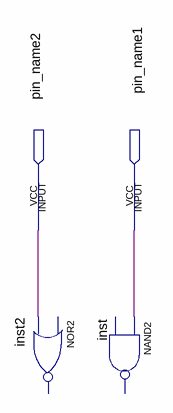
[diagram p0: schematic sheet]
// Quartus schematic Somador_74_283.bdf as structural Verilog: 2 symbols, 2 pins
module Somador_74_283 (
  input  pin_name2,
  input  pin_name1
);

  // NOR2 inst2 has open pins: IN1=open, IN2=pin_name2, OUT=open
  // NAND2 inst has open pins: IN1=pin_name1, IN2=open, OUT=open
endmodule
